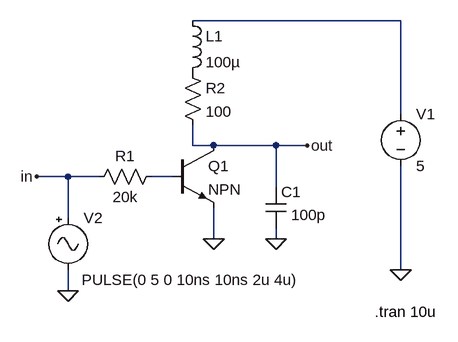
[diagram p0: schematic 3.5.asc]
3.5.asc, the LTspice schematic file:
Version 4
SHEET 1 1188 680
WIRE 496 -112 176 -112
WIRE 496 32 496 -112
WIRE 176 80 176 48
WIRE 208 80 176 80
WIRE 304 80 208 80
WIRE 352 80 304 80
WIRE -16 128 -64 128
WIRE 32 128 -16 128
WIRE 144 128 112 128
WIRE 304 144 304 80
WIRE -16 192 -16 128
WIRE 208 224 208 176
WIRE 304 224 304 208
WIRE 496 272 496 112
WIRE -16 304 -16 272
FLAG -16 304 0
FLAG 208 224 0
FLAG 304 224 0
FLAG 496 272 0
FLAG -64 128 in
FLAG 352 80 out
SYMBOL Misc\\signal -16 176 R0
WINDOW 123 0 0 Left 2
WINDOW 39 0 0 Left 2
WINDOW 3 21 111 Left 2
SYMATTR InstName V2
SYMATTR Value PULSE(0 5 0 10ns 10ns 2u 4u)
SYMBOL res 128 112 R90
WINDOW 0 0 56 VBottom 2
WINDOW 3 32 56 VTop 2
SYMATTR InstName R1
SYMATTR Value 20k
SYMBOL res 160 -48 R0
SYMATTR InstName R2
SYMATTR Value 100
SYMBOL voltage 496 16 R0
WINDOW 123 0 0 Left 2
WINDOW 39 0 0 Left 2
SYMATTR InstName V1
SYMATTR Value 5
SYMBOL cap 288 144 R0
WINDOW 3 39 43 Left 2
SYMATTR InstName C1
SYMATTR Value 100p
SYMBOL npn 144 80 R0
SYMATTR InstName Q1
SYMBOL ind 160 -128 R0
SYMATTR InstName L1
SYMATTR Value 100µ
TEXT 456 336 Left 2 !.tran 10u

The netlist it stands for:
* 3.5.asc
V2 in 0 PULSE(0 5 0 10ns 10ns 2u 4u)
R1 N002 in 20k
R2 P001 out 100
V1 N001 0 5
C1 out 0 100p
Q1 out N002 0 0 NPN
L1 N001 P001 100µ
.model NPN NPN
.model PNP PNP
.lib standard.bjt
.tran 10u
.backanno
.end